# EAGLE schematic rpi_pwrspl (EAGLE 9.6.2)

## Sheet 1 of 2
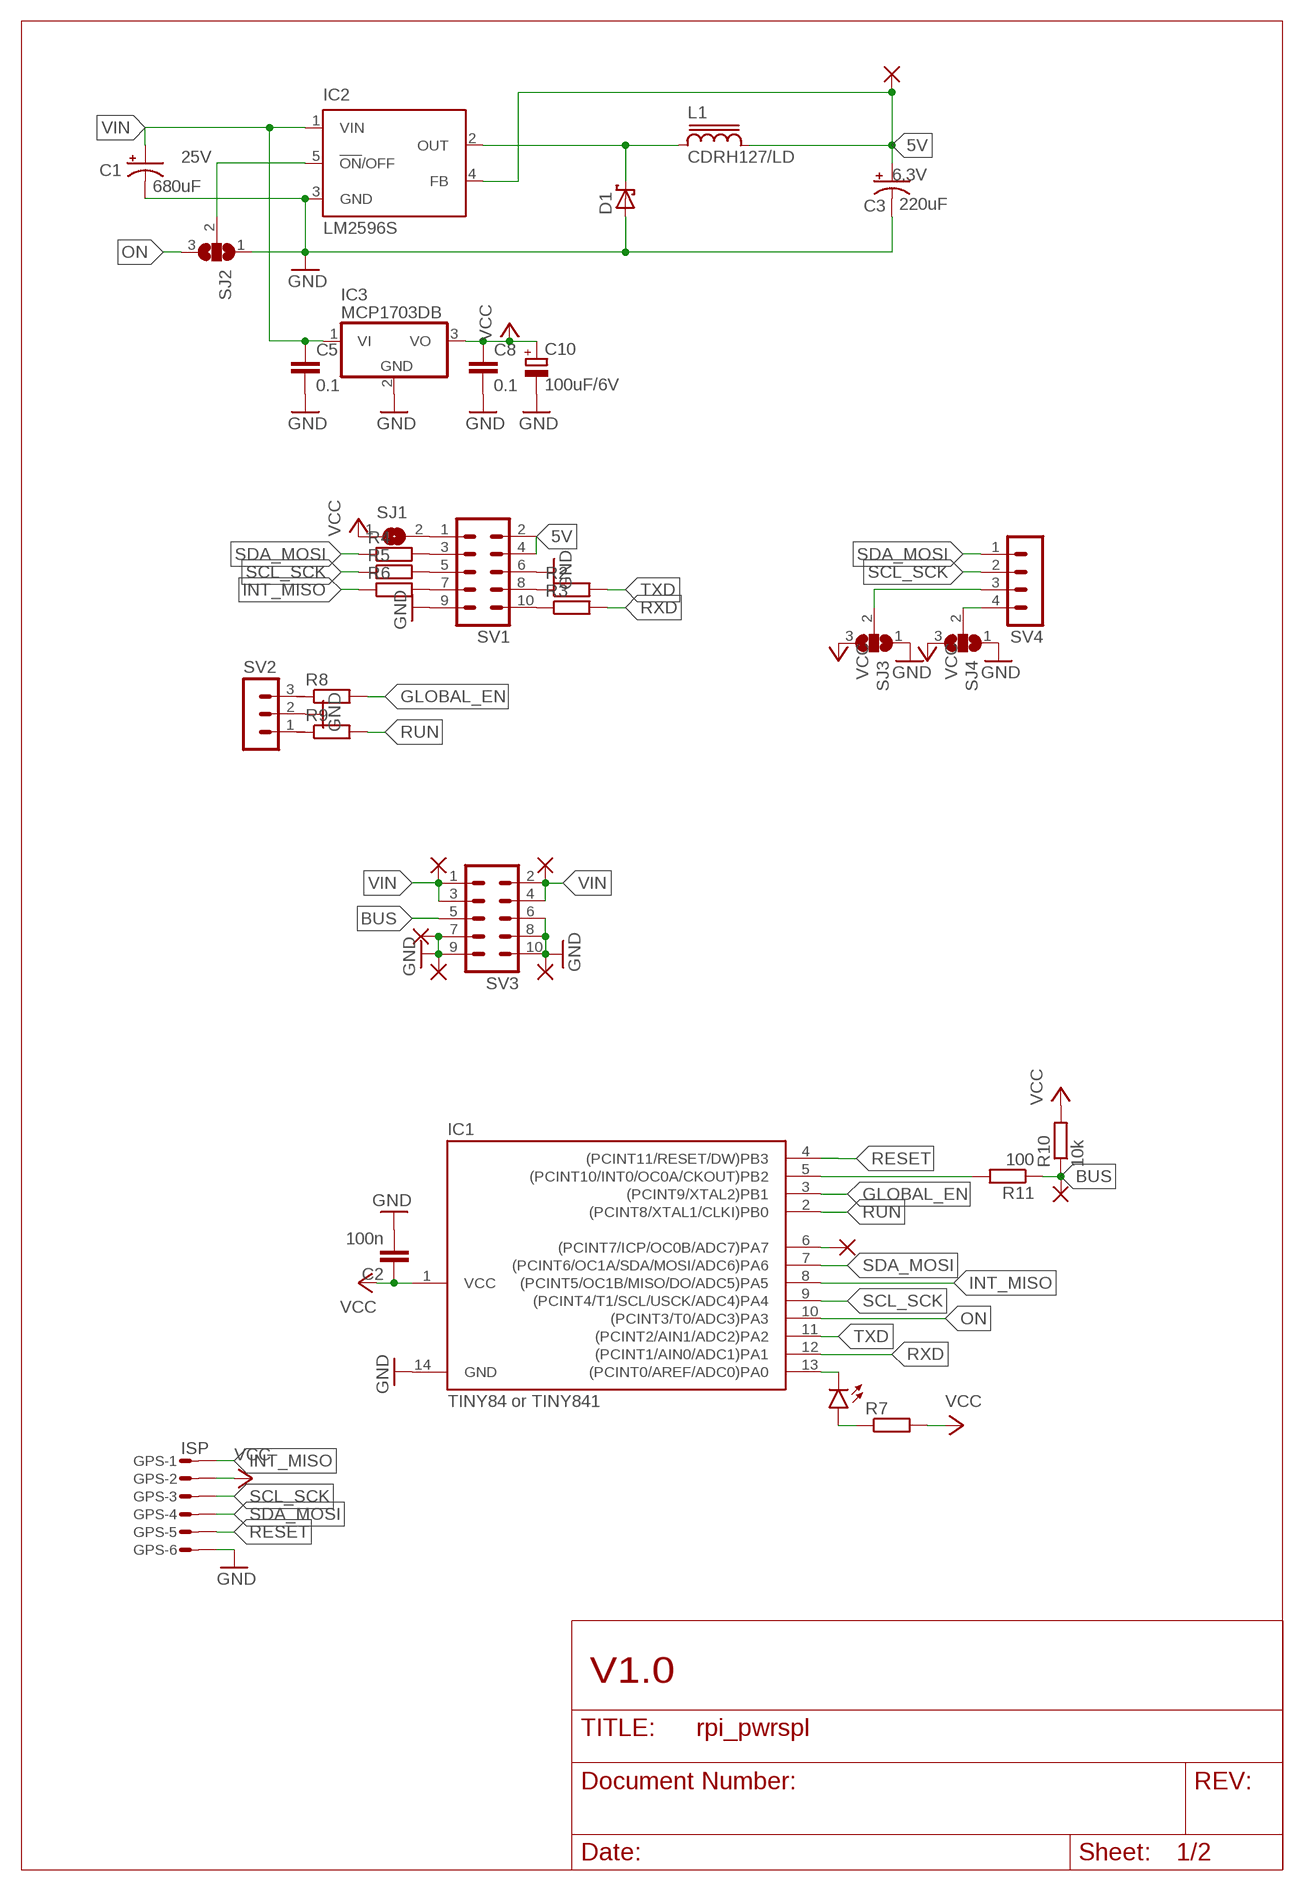
[diagram p0: schematic, sheet 1]

### Parts
C1  680uF  CPOL-USE5-10.5  [E5-10,5]
C2  100n  C-EUC0805  [C0805]
C3  220uF  CPOL-USUD-6,3X5,8  [UD-6,3X5,8_NICHICON]
C5  0.1  C-EUC0805  [C0805]
C8  0.1  C-EUC0805  [C0805]
C10  100uF/6V  CPOL-EUB/3528-21R  [B/3528-21R]
D1  SCHOTTKY-DIODESMD  [SMB]
GPS  ISP  MICROMATCH-6SMD  [MICROMATCH-6SMD]
IC1  TINY84 or TINY841  TINY24/44/84-SSU  [SOIC14]
IC2  LM2596S  [TO263-5]
IC3  MCP1703DB  [SOT223]
L1  CDRH127/LD  [CDRH127/LD]
LED  LEDCHIPLED_0805  [CHIPLED_0805]
PAD1  1,6/0,9  [1,6/0,9]
PAD2  1,6/0,9  [1,6/0,9]
PAD3  1,6/0,9  [1,6/0,9]
PAD4  2,54/1,1  [2,54/1,1]
PAD5  2,54/1,1  [2,54/1,1]
PAD6  1,6/0,9  [1,6/0,9]
PAD7  1,6/0,9  [1,6/0,9]
PAD8  2,54/1,1  [2,54/1,1]
R2  R-EU_M0805  [M0805]
R3  R-EU_M0805  [M0805]
R4  R-EU_M0805  [M0805]
R5  R-EU_M0805  [M0805]
R6  R-EU_M0805  [M0805]
R7  100  R-EU_R0603  [R0603]
R8  R-EU_M0805  [M0805]
R9  R-EU_M0805  [M0805]
R10  10k  R-EU_M0805  [M0805]
R11  100  R-EU_M0805  [M0805]
SJ1  SJ  [SJ]
SJ2  SJ2W  [SJ_2]
SJ3  SJ2W  [SJ_2]
SJ4  SJ2W  [SJ_2]
SV1  MA05-2  [MA05-2]
SV2  MA03-1  [MA03-1]
SV3  MA05-2  [MA05-2]
SV4  MA04-1  [MA04-1]

### Nets
5V: C3.+ IC2.4(FB) L1.2 PAD6.1(P) SV1.2 SV1.4
BUS: PAD5.1(P) R10.1 R11.1 SV3.5
GLOBAL_EN: IC1.3((PCINT9/XTAL2)PB1) R8.2
GND: C1.- C2.2 C3.- C5.2 C8.2 C10.- D1.A GPS.6 IC1.14(GND) IC2.3(GND) IC3.2(GND) PAD2.1(P) PAD3.1(P) PAD8.1(P) SJ2.1 SJ3.1 SJ4.1 SV1.6 SV1.9 SV2.2 SV3.6 SV3.7 SV3.8 SV3.9 SV3.10
INT_MISO: GPS.1 IC1.8((PCINT5/OC1B/MISO/DO/ADC5)PA5) R6.1
N$1: SJ1.2 SV1.1
N$3: R2.1 SV1.8
N$4: R3.1 SV1.10
N$5: R4.2 SV1.3
N$6: LED.A R7.1
N$7: R5.2 SV1.5
N$8: R6.2 SV1.7
N$9: IC2.5(!ON!/OFF) SJ2.2
N$10: SJ4.2 SV4.4
N$11: SJ3.2 SV4.3
N$12: IC1.6((PCINT7/ICP/OC0B/ADC7)PA7) PAD7.1(P)
N$15: IC1.5((PCINT10/INT0/OC0A/CKOUT)PB2) R11.2
ON: IC1.10((PCINT3/T0/ADC3)PA3) SJ2.3
OUT: D1.C IC2.2(OUT) L1.1
PA0: IC1.13((PCINT0/AREF/ADC0)PA0) LED.C
RESET: GPS.5 IC1.4((PCINT11/RESET/DW)PB3)
RUN: IC1.2((PCINT8/XTAL1/CLKI)PB0) R9.2
RXD: IC1.12((PCINT1/AIN0/ADC1)PA1) R3.2
SCL_SCK: GPS.3 IC1.9((PCINT4/T1/SCL/USCK/ADC4)PA4) R5.1 SV4.2
SDA_MOSI: GPS.4 IC1.7((PCINT6/OC1A/SDA/MOSI/ADC6)PA6) R4.1 SV4.1
TXD: IC1.11((PCINT2/AIN1/ADC2)PA2) R2.2
VCC: C2.1 C8.1 C10.+ GPS.2 IC1.1(VCC) IC3.3(VO) R7.2 R10.2 SJ1.1 SJ3.3 SJ4.3
VIN: C1.+ C5.1 IC2.1(VIN) IC3.1(VI) PAD1.1(P) PAD4.1(P) SV3.1 SV3.2 SV3.3 SV3.4
Unconnected: R8.1 R9.1 SV2.1 SV2.3

### Notes on the sheet
- V1.0

## Sheet 2 of 2

## Library data of the parts
C1 = rcl:CPOL-US: POLARIZED CAPACITOR, American symbol; VOLTAGE: 25V
C2 C5 C8 = rcl:C-EU: CAPACITOR, European symbol
C3 = rcl:CPOL-US: POLARIZED CAPACITOR, American symbol; VOLTAGE: 6.3V
C10 = rcl:CPOL-EU: POLARIZED CAPACITOR, European symbol
D1 = diode:SCHOTTKY-DIODE: Schottky Diode
GPS = con-amp-micromatch:MICROMATCH-6: MicroMaTch 6 7-215464-6 / 0-215464-6 Drawing Number C-215464 DDEController.pdf
IC1 = avr-7:TINY24/44/84
IC2 = national-semiconductor:LM2596: SIMPLE SWITCHER® Power Converter 150 kHz 3A Step-Down Voltage Regulator Source: http://www.national.com/ds/LM/LM2596.pdf; MF: NATIONAL SEMICONDUCTOR; MPN: LM2596S-ADJ/NOPB; OC_FARNELL: 9494367; OC_NEWARK: 41K3842
IC3 = linear:MCP1703: 250 mA, 16V, Low Quiescent Current LDO Regulator Source: http://ww1.microchip.com/downloads/en/DeviceDoc/22049b.pdf
L1 = inductor-sumida:CDRH127/LD: Power Inductor
LED = led:LED: LED OSRAM: - CHIPLED LG R971, LG N971, LY N971, LG Q971, LY Q971, LO R971, LY R971 LH N974, LH R974 LS Q976, LO Q976, LY Q976 LO Q996 - Hyper CHIPLED LW Q18S LB Q993, LB Q99A, LB R99A - SideLED LS A670, LO A670, LY A670, LG A670, LP A670 LB A673, LV A673, LT A673, LW A673 LH A674 LY A675 LS A676, LA A676, LO A676, LY A676, LW A676 LS A679, LY A679, LG A679 - Hyper Micro SIDELED® LS Y876, LA Y876, LO Y876, LY Y876 LT Y87S - SmartLED LW L88C, LW L88S LB L89C, LB L89S, LG L890 LS L89K, LO L89K, LY L89K LS L896, LA L896, LO L896, LY L896 - TOPLED LS T670, LO T670, LY T670, LG T670, LP T670 LSG T670, LSP T670, LSY T670, LOP T670, LYG T670 LG T671, LOG T671, LSG T671 LB T673, LV T673, LT T673, LW T673 LH T674 LS T676, LA T676, LO T676, LY T676, LB T676, LH T676, LSB T676, LW T676 LB T67C, LV T67C, LT T67C, LS T67K, LO T67K, LY T67K, LW E67C LS E67B, LA E67B, LO E67B, LY E67B, LB E67C, LV E67C, LT E67C LW T67C LS T679, LY T679, LG T679 LS T770, LO T770, LY T770, LG T770, LP T770 LB T773, LV T773, LT T773, LW T773 LH T774 LS E675, LA E675, LY E675, LS T675 LS T776, LA T776, LO T776, LY T776, LB T776 LHGB T686 LT T68C, LB T68C - Hyper Mini TOPLED® LB M676 - Mini TOPLED Santana® LG M470 LS M47K, LO M47K, LY M47K Source: http://www.osram.convergy.de LUXEON: - LUMILED® LXK2-PW12-R00, LXK2-PW12-S00, LXK2-PW14-U00, LXK2-PW14-V00 LXK2-PM12-R00, LXK2-PM12-S00, LXK2-PM14-U00 LXK2-PE12-Q00, LXK2-PE12-R00, LXK2-PE12-S00, LXK2-PE14-T00, LXK2-PE14-U00 LXK2-PB12-K00, LXK2-PB12-L00, LXK2-PB12-M00, LXK2-PB14-N00, LXK2-PB14-P00, LXK2-PB14-Q00 LXK2-PR12-L00, LXK2-PR12-M00, LXK2-PR14-Q00, LXK2-PR14-R00 LXK2-PD12-Q00, LXK2-PD12-R00, LXK2-PD12-S00 LXK2-PH12-R00, LXK2-PH12-S00 LXK2-PL12-P00, LXK2-PL12-Q00, LXK2-PL12-R00 Source: www.luxeon.com KINGBRIGHT: KA-3528ASYC Source: www.kingbright.com
PAD1-PAD3 PAD6 PAD7 = wirepad:1,6/0,9: THROUGH-HOLE PAD
PAD4 PAD5 PAD8 = wirepad:2,54/1,1: THROUGH-HOLE PAD
R2-R11 = rcl:R-EU_: RESISTOR, European symbol; SPICEPREFIX: R
SJ1 = jumper:SJ: SMD solder JUMPER
SJ2-SJ4 = jumper:SJ2W: SMD solder JUMPER
SV1 SV3 = con-lstb:MA05-2: PIN HEADER; OC_FARNELL: unknown; OC_NEWARK: unknown
SV2 = con-lstb:MA03-1: PIN HEADER; OC_FARNELL: unknown; OC_NEWARK: unknown
SV4 = con-lstb:MA04-1: PIN HEADER; OC_FARNELL: unknown; OC_NEWARK: unknown

## Net classes
1 gnd: width 0.508 mm, drill 0.254 mm
2 power: width 0.508 mm, drill 0.254 mm